# EAGLE design APM1_oilpan-V1 (EAGLE 9.6.2)
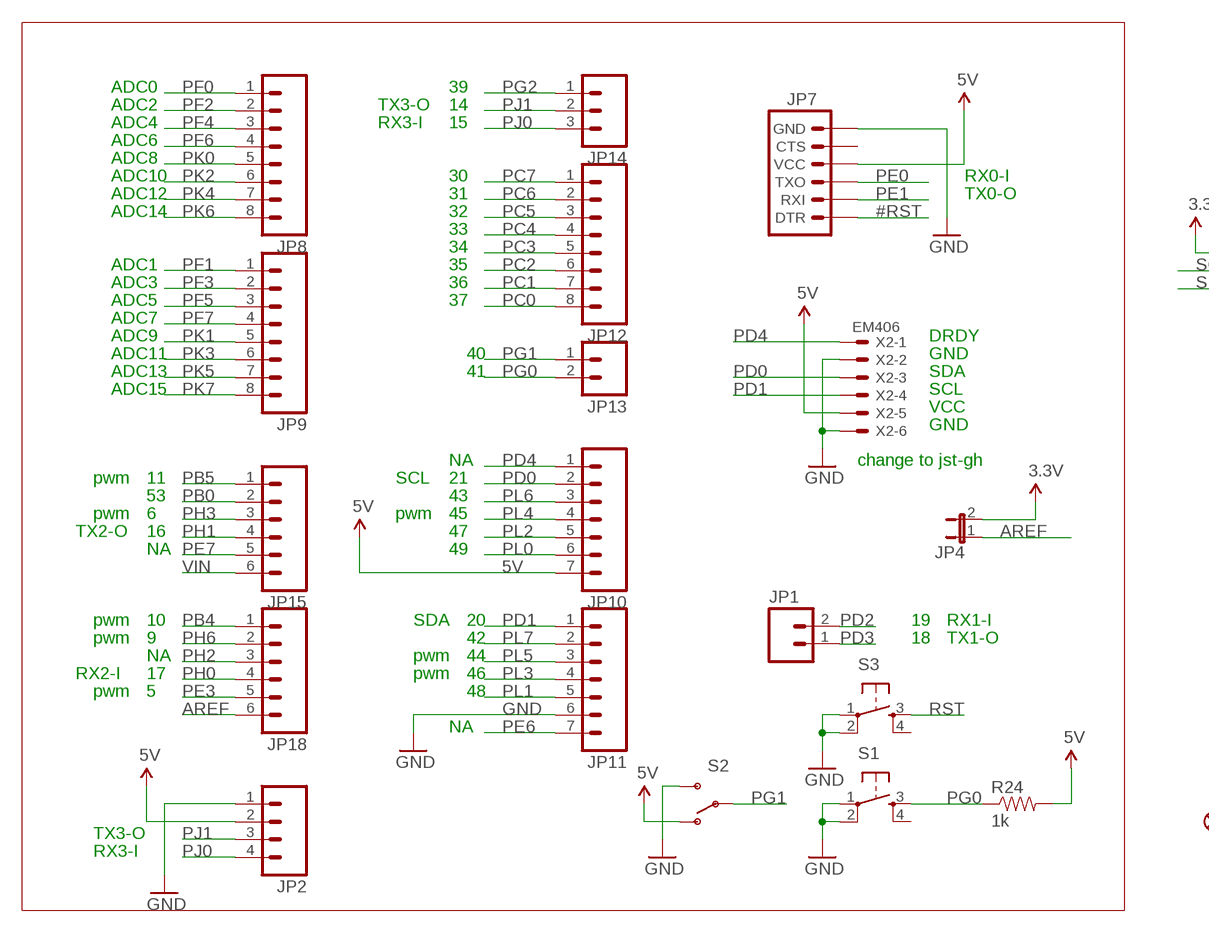
[diagram p0: schematic, sheet 1, part 1 of 2]
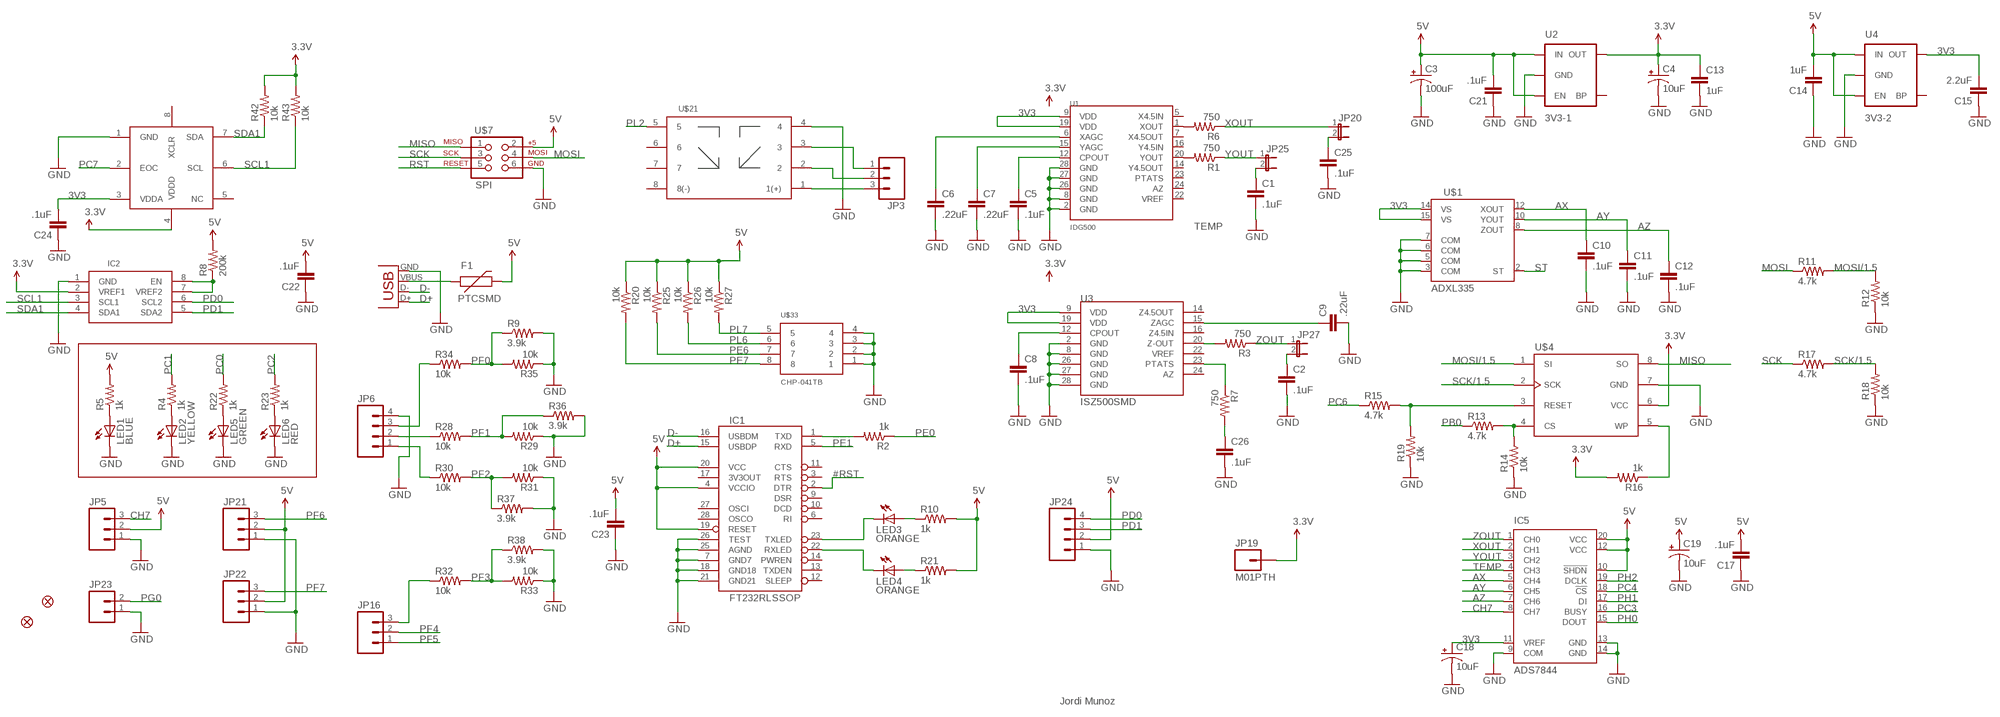
[diagram p1: schematic, sheet 1, part 2 of 2]

## Parts
C1  .1uF  CAP0402  [C0402]
C2  .1uF  CAP0402  [C0402]
C3  100uF  CAP_POL3528  [EIA3528]
C4  10uF  CAP_POL1206  [EIA3216]
C5  .1uF  CAP0402  [C0402]
C6  .22uF  CAP0402  [C0402]
C7  .22uF  CAP0402  [C0402]
C8  .1uF  CAP0402  [C0402]
C9  .22uF  CAP0402  [C0402]
C10  .1uF  CAP0402  [C0402]
C11  .1uF  CAP0402  [C0402]
C12  .1uF  CAP0402  [C0402]
C13  1uF  CAP0402  [C0402]
C14  1uF  CAP0402  [C0402]
C15  2.2uF  CAP0402  [C0402]
C17  .1uF  CAP0402  [C0402]
C18  10uF  CAP_POL1206  [EIA3216]
C19  10uF  CAP_POL1206  [EIA3216]
C21  .1uF  CAP0402  [C0402]
C22  .1uF  CAP0402  [C0402]
C23  .1uF  CAP0402  [C0402]
C24  .1uF  CAP0402  [C0402]
C25  .1uF  CAP0402  [C0402]
C26  .1uF  CAP0402  [C0402]
F1  PTCSMD  [PTC-1206]
IC1  FT232RLSSOP  [SSOP28DB]
IC2  PCA9306  [SOIC8]
IC5  ADS7844  ADS8344U  [SSOP20BU]
JP1  M02PTH  [1X02]
JP2  M04PTH  [1X04]
JP3  M03PTH  [1X03]
JP4  JUMPER-2SMD-NO  [SJ_2S-NO]
JP5  M03PTH  [1X03]
JP6  M04PTH  [1X04]
JP7  ARDUINO_SERIAL_PROGRAMPTH  [1X06]
JP8  M08  [1X08]
JP9  M08  [1X08]
JP10  M07  [1X07]
JP11  M07  [1X07]
JP12  M08  [1X08]
JP13  M02PTH  [1X02]
JP14  M03PTH  [1X03]
JP15  M06SIP  [1X06]
JP16  M03PTH  [1X03]
JP17  FIDUCIAL1X2.5  [FIDUCIAL-1X2.5]
JP18  M06SIP  [1X06]
JP19  M01PTH  [1X01]
JP20  JUMPER-2SMD-NO  [SJ_2S-NO]
JP21  M03PTH  [1X03]
JP22  M03PTH  [1X03]
JP23  M02PTH  [1X02]
JP24  M04PTH  [1X04]
JP25  JUMPER-2SMD-NO  [SJ_2S-NO]
JP26  FIDUCIAL1X2.5  [FIDUCIAL-1X2.5]
JP27  JUMPER-2SMD-NO  [SJ_2S-NO]
LED1  BLUE  LED0603  [LED-0603]
LED2  YELLOW  LED0603  [LED-0603]
LED3  ORANGE  LED0603  [LED-0603]
LED4  ORANGE  LED0603  [LED-0603]
LED5  GREEN  LED0603  [LED-0603]
LED6  RED  LED0603  [LED-0603]
R1  750  RESISTOR0402  [C0402]
R2  1k  RESISTOR0402  [C0402]
R3  750  RESISTOR0402  [C0402]
R4  1k  RESISTOR0402  [C0402]
R5  1k  RESISTOR0402  [C0402]
R6  750  RESISTOR0402  [C0402]
R7  750  RESISTOR0402  [C0402]
R8  200k  RESISTOR0402  [C0402]
R9  3.9k  RESISTOR0402  [C0402]
R10  1k  RESISTOR0402  [C0402]
R11  4.7k  RESISTOR0402  [C0402]
R12  10k  RESISTOR0402  [C0402]
R13  4.7k  RESISTOR0402  [C0402]
R14  10k  RESISTOR0402  [C0402]
R15  4.7k  RESISTOR0402  [C0402]
R16  1k  RESISTOR0402  [C0402]
R17  4.7k  RESISTOR0402  [C0402]
R18  10k  RESISTOR0402  [C0402]
R19  10k  RESISTOR0402  [C0402]
R20  10k  RESISTOR0402  [C0402]
R21  1k  RESISTOR0402  [C0402]
R22  1k  RESISTOR0402  [C0402]
R23  1k  RESISTOR0402  [C0402]
R24  1k  RESISTOR0402  [C0402]
R25  10k  RESISTOR0402  [C0402]
R26  10k  RESISTOR0402  [C0402]
R27  10k  RESISTOR0402  [C0402]
R28  10k  RESISTOR0402  [C0402]
R29  10k  RESISTORPTH1  [AXIAL-0.3]
R30  10k  RESISTOR0402  [C0402]
R31  10k  RESISTORPTH1  [AXIAL-0.3]
R32  10k  RESISTOR0402  [C0402]
R33  10k  RESISTORPTH1  [AXIAL-0.3]
R34  10k  RESISTOR0402  [C0402]
R35  10k  RESISTORPTH1  [AXIAL-0.3]
R36  3.9k  RESISTOR0402  [C0402]
R37  3.9k  RESISTOR0402  [C0402]
R38  3.9k  RESISTOR0402  [C0402]
R42  10k  RESISTOR0402  [C0402]
R43  10k  RESISTOR0402  [C0402]
S1  TAC_SWITCHSMD  [TACTILE_SWITCH_SMD]
S2  SWITCH-SPSTSMD2  [SWITCH-SPDT-SMD]
S3  TAC_SWITCHSMD  [TACTILE_SWITCH_SMD]
U1  IDG500  [QFN-28_6X8]
U2  3V3-1  V_REG_LDOSMD  [SOT23-5]
U3  ISZ500SMD  [QFN-28_6X8]
U4  3V3-2  V_REG_LDOSMD  [SOT23-5]
U$1  ADXL335  ADXL330SMD  [LFCSP-16]
U$4  DF  ATMEL_DATA_FLASH  [SO08WIDE]
U$7  SPI  AVR_SPI_PRG_6NS  [2X3-NS]
U$8  BMP085  [BMP085]
U$21  RELAY_23  [RELAY_23]
U$33  CHP-041TB  [CHP-041TB]
X1  USBSMD  [USB-MINIB]
X2  EM406  GH-06V  [GH-06V]

## Nets
3.3V: C4.A(+) C13.1 IC2.2(VREF1) JP4.2 JP19.1 R16.2 R42.2 R43.2 U2.5(OUT) U$4.6(VCC) U$8.4(VDDD)
3V3: C15.2 C18.A(+) C24.2 IC5.11(VREF) U1.9(VDD) U1.19(VDD) U3.9(VDD) U3.19(VDD) U4.5(OUT) U$1.14(VS) U$1.15(VS) U$8.3(VDDA)
5V: C3.A(+) C14.2 C17.2 C19.A(+) C21.2 C22.2 C23.2 F1.2 IC1.4(VCCIO) IC1.19(RESET) IC1.20(VCC) IC5.10(!SHDN) IC5.12(VCC) IC5.20(VCC) JP2.2 JP5.2 JP7.4(VCC) JP10.7 JP21.2 JP22.2 JP24.2 R5.2 R8.2 R10.2 R20.1 R21.2 R24.2 R25.1 R26.1 R27.1 S2.1(O) U2.1(IN) U2.3(EN) U4.1(IN) U4.3(EN) U$7.2 X2.5
#RST: IC1.2(DTR) JP7.1(DTR)
AREF: JP4.1 JP18.6
AX: C10.1 IC5.5(CH4) U$1.12(XOUT)
AY: C11.1 IC5.6(CH5) U$1.10(YOUT)
AZ: C12.1 IC5.7(CH6) U$1.8(ZOUT)
CH7: IC5.8(CH7) JP5.3
D+: IC1.15(USBDP) X1.D+
D-: IC1.16(USBDM) X1.D-
GND: C1.2 C2.2 C3.C(-) C4.C(-) C5.2 C6.2 C7.2 C8.2 C9.2 C10.2 C11.2 C12.2 C13.2 C14.1 C15.1 C17.1 C18.C(-) C19.C(-) C21.1 C22.1 C23.1 C24.1 C25.2 C26.2 IC1.7(GND7) IC1.18(GND18) IC1.21(GND21) IC1.25(AGND) IC1.26(TEST) IC2.1(GND) IC5.9(COM) IC5.13(GND) IC5.14(GND) JP2.1 JP5.1 JP6.4 JP7.6(GND) JP11.6 JP21.1 JP22.1 JP23.1 JP24.1 LED1.C LED2.C LED5.C LED6.C R9.2 R12.1 R14.1 R18.1 R19.1 R29.P$1 R31.P$1 R33.P$1 R35.P$1 R36.2 R37.2 R38.2 S1.1 S1.2 S2.3(S) S3.1 S3.2 U1.2(GND) U1.8(GND) U1.26(GND) U1.27(GND) U1.28(GND) U2.2(GND) U3.2(GND) U3.8(GND) U3.26(GND) U3.27(GND) U3.28(GND) U4.2(GND) U$1.3(COM) U$1.5(COM) U$1.6(COM) U$1.7(COM) U$4.7(GND) U$7.6 U$8.1(GND) U$21.4 U$33.1 U$33.2 U$33.3 U$33.4 X1.GND X2.2 X2.6
MISO: U$4.8(SO) U$7.1
MOSI: R11.1 U$7.4
MOSI/1.5: R11.2 R12.2 U$4.1(SI)
N$1: LED1.A R5.1
N$2: LED2.A R4.1
N$3: C8.1 U3.12(CPOUT)
N$4: C9.1 U3.15(ZAGC)
N$5: LED3.A R10.1
N$6: IC1.1(TXD) R2.2
N$7: R15.2 R19.2 U$4.3(RESET)
N$8: R3.2 U3.20(Z-OUT)
N$9: R7.1 U3.23(PTATS)
N$10: IC2.7(VREF2) IC2.8(EN) R8.1
N$11: JP3.1 U$21.3
N$12: R1.2 U1.20(YOUT)
N$13: C6.1 U1.6(XAGC)
N$14: R13.2 R14.2 U$4.4(CS)
N$15: R6.2 U1.1(XOUT)
N$16: C5.1 U1.12(CPOUT)
N$17: F1.1 X1.VBUS
N$18: C7.1 U1.15(YAGC)
N$20: C2.1 JP27.2
N$21: JP3.2 U$21.2
N$22: LED4.A R21.1
N$23: C25.1 JP20.2
N$24: IC1.23(TXLED) LED3.C
N$25: IC1.22(RXLED) LED4.C
N$26: LED5.A R22.1
N$27: LED6.A R23.1
N$28: JP3.3 U$21.1(1(+))
N$29: C1.1 JP25.2
N$34: JP6.2 R28.1
N$36: JP6.1 R30.1
N$38: JP16.3 R32.1
N$40: JP6.3 R34.1
PB0: JP15.2 R13.1
PB4: JP18.1
PB5: JP15.1
PC0: JP12.8 R22.2
PC1: JP12.7 R4.2
PC2: JP12.6 R23.2
PC3: IC5.16(BUSY) JP12.5
PC4: IC5.18(!CS) JP12.4
PC5: JP12.3
PC6: JP12.2 R15.1
PC7: JP12.1 U$8.2(EOC)
PD0: IC2.6(SCL2) JP10.2 JP24.4 X2.3
PD1: IC2.5(SDA2) JP11.1 JP24.3 X2.4
PD2: JP1.2
PD3: JP1.1
PD4: JP10.1 X2.1
PE0: JP7.3(TXO) R2.1
PE1: IC1.5(RXD) JP7.2(RXI)
PE3: JP18.5
PE6: JP11.7 R25.2 U$33.7
PE7: JP15.5 R20.2 U$33.8
PF0: JP8.1 R9.1 R34.2 R35.P$2
PF1: JP9.1 R28.2 R29.P$2 R36.1
PF2: JP8.2 R30.2 R31.P$2 R37.1
PF3: JP9.2 R32.2 R33.P$2 R38.1
PF4: JP8.3 JP16.2
PF5: JP9.3 JP16.1
PF6: JP8.4 JP21.3
PF7: JP9.4 JP22.3
PG0: JP13.2 JP23.2 R24.1 S1.3
PG1: JP13.1 S2.2(P)
PG2: JP14.1
PH0: IC5.15(DOUT) JP18.4
PH1: IC5.17(DI) JP15.4
PH2: IC5.19(DCLK) JP18.3
PH3: JP15.3
PH6: JP18.2
PJ0: JP2.4 JP14.3
PJ1: JP2.3 JP14.2
PK0: JP8.5
PK1: JP9.5
PK2: JP8.6
PK3: JP9.6
PK4: JP8.7
PK5: JP9.7
PK6: JP8.8
PK7: JP9.8
PL0: JP10.6
PL1: JP11.5
PL2: JP10.5 U$21.5
PL3: JP11.4
PL4: JP10.4
PL5: JP11.3
PL6: JP10.3 R26.2 U$33.6
PL7: JP11.2 R27.2 U$33.5
RST: S3.3 U$7.5
SCK: R17.1 U$7.3
SCK/1.5: R17.2 R18.2 U$4.2(SCK)
SCL1: IC2.3(SCL1) R43.1 U$8.6(SCL)
SDA1: IC2.4(SDA1) R42.1 U$8.7(SDA)
ST: U$1.2(ST)
TEMP: C26.1 IC5.4(CH3) R7.2
VIN: JP15.6
WP: R16.1 U$4.5(WP)
XOUT: IC5.2(CH1) JP20.1 R6.1
YOUT: IC5.3(CH2) JP25.1 R1.1
ZOUT: IC5.1(CH0) JP27.1 R3.1
Unconnected: IC1.3(RTS) IC1.6(RI) IC1.9(DSR) IC1.10(DCD) IC1.11(CTS) IC1.12(SLEEP) IC1.13(TXDEN) IC1.14(PWREN) IC1.17(3V3OUT) IC1.27(OSCI) IC1.28(OSCO) JP7.5(CTS) S1.4 S3.4 U1.5(X4.5IN) U1.7(X4.5OUT) U1.14(Y4.5OUT) U1.16(Y4.5IN) U1.22(VREF) U1.23(PTATS) U1.24(AZ) U2.4(BP) U3.14(Z4.5OUT) U3.16(Z4.5IN) U3.22(VREF) U3.24(AZ) U4.4(BP) U$8.5(NC) U$8.8(XCLR) U$21.6 U$21.7

## Notes on the sheet
- ADC0 | 39
- ADC2 | TX3-O | 14
- ADC4 | RX3-I | 15
- ADC6
- ADC8
- ADC10 | 30 | RX0-I
- ADC12 | 31 | TX0-O
- ADC14 | 32
- 33
- 34
- ADC1 | 35
- ADC3 | 36
- ADC5 | 37
- ADC7
- ADC9 | DRDY
- ADC11 | 40 | GND
- ADC13 | 41 | SDA
- ADC15 | SCL
- VCC
- GND
- NA | change to jst-gh
- pwm | 11 | SCL | 21
- 53 | 43
- pwm | 6 | pwm | 45
- TX2-O | 16 | 47
- NA | 49
- pwm | 10 | SDA | 20 | 19 | RX1-I
- pwm | 9 | 42 | 18 | TX1-O
- NA | pwm | 44
- RX2-I | 17 | pwm | 46
- pwm | 5 | 48
- NA
- TX3-O
- RX3-I
- Jordi Munoz

## Power pins joined to a net without a drawn wire
8(-): U$21.8(8(-))

## Library data of the parts
C1 C2 C5-C15 C17 C21-C26 = DIYdrones3:CAP: Capacitor Standard 0603 ceramic capacitor, and 0.1" leaded capacitor.
C3 C4 C18 C19 = DIYdrones3:CAP_POL: Capacitor Polarized These are standard SMD and PTH capacitors. Normally 10uF, 47uF, and 100uF in electrolytic and tantalum varieties. Always verify the external diameter of the through hole cap, it varies with capacity, voltage, and manufacturer. The EIA devices should be standard.
F1 = DIYdrones3:PTC: Resettable Fuse PTC Resettable Fuse. Spark Fun Electronics SKU : COM-08357
IC1 = SparkFun:FT232RL: USB UART FT232RL 4th Generation USB UART (USB <-> Serial) Controller. Spark Fun Electronics SKU : COM-00650
IC2 = DIYdrones:PCA9306: I2C Level translator. Digi-Key part: 568-4215-1-ND By Jordi Munoz
IC5 = burr-brown:ADS8344: 16-Bit, 8-Channel Serial Output Sampling ADC
JP1 JP13 JP23 = DIYdrones3:M02: Header 2 Standard 2-pin 0.1" header. Use with straight break away headers (SKU : PRT-00116), right angle break away headers (PRT-00553), swiss pins (PRT-00743), machine pins (PRT-00117), and female headers (PRT-00115). Molex polarized connector foot print use with SKU : PRT-08233 with associated crimp pins and housings.
JP2 JP6 JP24 = DIYdrones3:M04: Header 4 Standard 4-pin 0.1" header. Use with straight break away headers (SKU : PRT-00116), right angle break away headers (PRT-00553), swiss pins (PRT-00743), machine pins (PRT-00117), and female headers (PRT-00115). Molex polarized connector foot print use with SKU : PRT-08231 with associated crimp pins and housings.
JP3 JP5 JP14 JP16 JP21 JP22 = DIYdrones3:M03: Header 3 Standard 3-pin 0.1" header. Use with straight break away headers (SKU : PRT-00116), right angle break away headers (PRT-00553), swiss pins (PRT-00743), machine pins (PRT-00117), and female headers (PRT-00115). Molex polarized connector foot print use with SKU : PRT-08232 with associated crimp pins and housings.
JP4 JP20 JP25 JP27 = DIYdrones3:JUMPER-2: Jumper Basic 0.1" spaced jumper. Use with breakaway headers.
JP7 = DIYdrones3:ARDUINO_SERIAL_PROGRAM
JP8 JP9 JP12 = DIYdrones3:M08: Header 8 Standard 8-pin 0.1" header. Use with straight break away headers (SKU : PRT-00116), right angle break away headers (PRT-00553), swiss pins (PRT-00743), machine pins (PRT-00117), and female headers (PRT-00115).
JP10 JP11 = DIYdrones3:M07: Header 7 Standard 7-pin 0.1" header. Use with straight break away headers (SKU : PRT-00116), right angle break away headers (PRT-00553), swiss pins (PRT-00743), machine pins (PRT-00117), and female headers (PRT-00115). NOTES ON THE VARIANTS LOCK and LOCK_LONGPADS... This footprint was designed to help hold the alignment of a through-hole component (i.e. 7-pin header) while soldering it into place. You may notice that each hole has been shifted either up or down by 0.005 of an inch from it's more standard position (which is usually a perfectly straight line). This slight alteration caused the pins (the squares in the middle) to touch the edges of the holes. Because they are alternating, it causes a "brace" to hold the header in place. 0.005 has proven to be the perfect amount of "off-center" position when using our standard breakaway headers. Although looks a little odd when you look at the bare footprint, once you have a header in there, the alteration is very hard to notice. Also, if you push a header all the way into place, it is covered up entirely on the bottom side. This idea of altering the position of holes to aid alignment will be further integrated into the Sparkfun Library for other footprints. It can help hold any component with 3 or more connection pins.
JP15 JP18 = DIYdrones3:M06: Header 6 Standard 6-pin 0.1" header. Use with straight break away headers (SKU : PRT-00116), right angle break away headers (PRT-00553), swiss pins (PRT-00743), machine pins (PRT-00117), and female headers (PRT-00115). Molex polarized connector foot print use with SKU : PRT-08094 with associated crimp pins and housings. NOTES ON THE VARIANTS LOCK and LOCK_LONGPADS... This footprint was designed to help hold the alignment of a through-hole component (i.e. 6-pin header) while soldering it into place. You may notice that each hole has been shifted either up or down by 0.005 of an inch from it's more standard position (which is a perfectly straight line). This slight alteration caused the pins (the squares in the middle) to touch the edges of the holes. Because they are alternating, it causes a "brace" to hold the component in place. 0.005 has proven to be the perfect amount of "off-center" position when using our standard breakaway headers. Although looks a little odd when you look at the bare footprint, once you have a header in there, the alteration is very hard to notice. Also, if you push a header all the way into place, it is covered up entirely on the bottom side. This idea of altering the position of holes to aid alignment will be further integrated into the Sparkfun Library for other footprints. It can help hold any component with 3 or more connection pins.
JP17 JP26 = SparkFun:FIDUCIAL: Fiducial Alignment Points Various fiducial points for machine vision alignment.
JP19 = DIYdrones3:M01: Header 1 Standard 1-pin 0.1" header. Use with straight break away headers (SKU : PRT-00116), right angle break away headers (PRT-00553), swiss pins (PRT-00743), machine pins (PRT-00117), and female headers (PRT-00115).
LED1-LED6 = DIYdrones3:LED: LEDs Standard schematic elements and footprints for 5mm, 3mm, 1206, and 0603 sized LEDs. 5mm - Spark Fun Electronics SKU : COM-00529 (and others)
R1-R38 R42 R43 = DIYdrones3:RESISTOR: Resistor Basic schematic elements and footprints for 0603, 1206, and PTH 1/10th watt (small) resistors.
S1 S3 = DIYdrones3:TAC_SWITCH: Momentary Switch Button commonly used for reset or general input. Spark Fun Electronics SKU : COM-00097
S2 = SparkFun:SWITCH-SPST: SPST Switch Simple slide switch. Spark Fun Electronics SKU : COM-00102
U1 = DIYdrones_112210:IDG500
U2 U4 = SparkFun:V_REG_LDO: Voltage Regulator LDO Standard 150mA LDO voltage regulator in SOT-23 layout. Micrel part MIC5205. BP (by-pass) pin is used to lower output noise with 470pF cap.
U3 = DIYdrones_112210:ISZ500: ISZ500 Single axis gyro
U$1 = DIYdrones3:ADXL330: Triple Axis Accelerometer Analog Devices ADXL330 +/-3g 2.4V-5.25V Analog output. Spark Fun Electronics SKU : COM-00730. Center pad paste layer has been reduced to avoid shorting.
U$4 = DIYdrones3:ATMEL_DATA_FLASH: 16Mbit EEPROM DataFlash Footprint needs touching up. Spark Fun Electronics SKU : COM-00301
U$7 = DIYdrones3:AVR_SPI_PRG_6: AVR ISP 6 Pin This is the reduced ISP connector for AVR programming. Common on Arduino. This footprint will take up less PCB space and can be used with a 10-pin to 6-pin adapter such as SKU: BOB-08508
U$8 = SparkFun:BMP085
U$21 = DIYdrones:RELAY_23
U$33 = DIYdrones:CHP-041TB: By Jordi Munoz, for DIYDrones.com (3DRRobotics LLC).
X1 = DIYdrones3:USB: USB Connectors USB-B-PTH is fully proven SKU : PRT-00139 USB-miniB is fully proven SKU : PRT-00587 USB-A-PCB is untested. USB-A-H is throughly reviewed, but untested. Spark Fun Electronics SKU : PRT-00437 USB-B-SMT is throughly reviewed, but untested. Needs silkscreen touching up. USB-A-S has not been used/tested USB-MB-H has not been used/tested
X2 = jst_gh_con:GH-06V: Disconnectable Crimp style connector, 1.25mm pitch 6 contacts

## Board
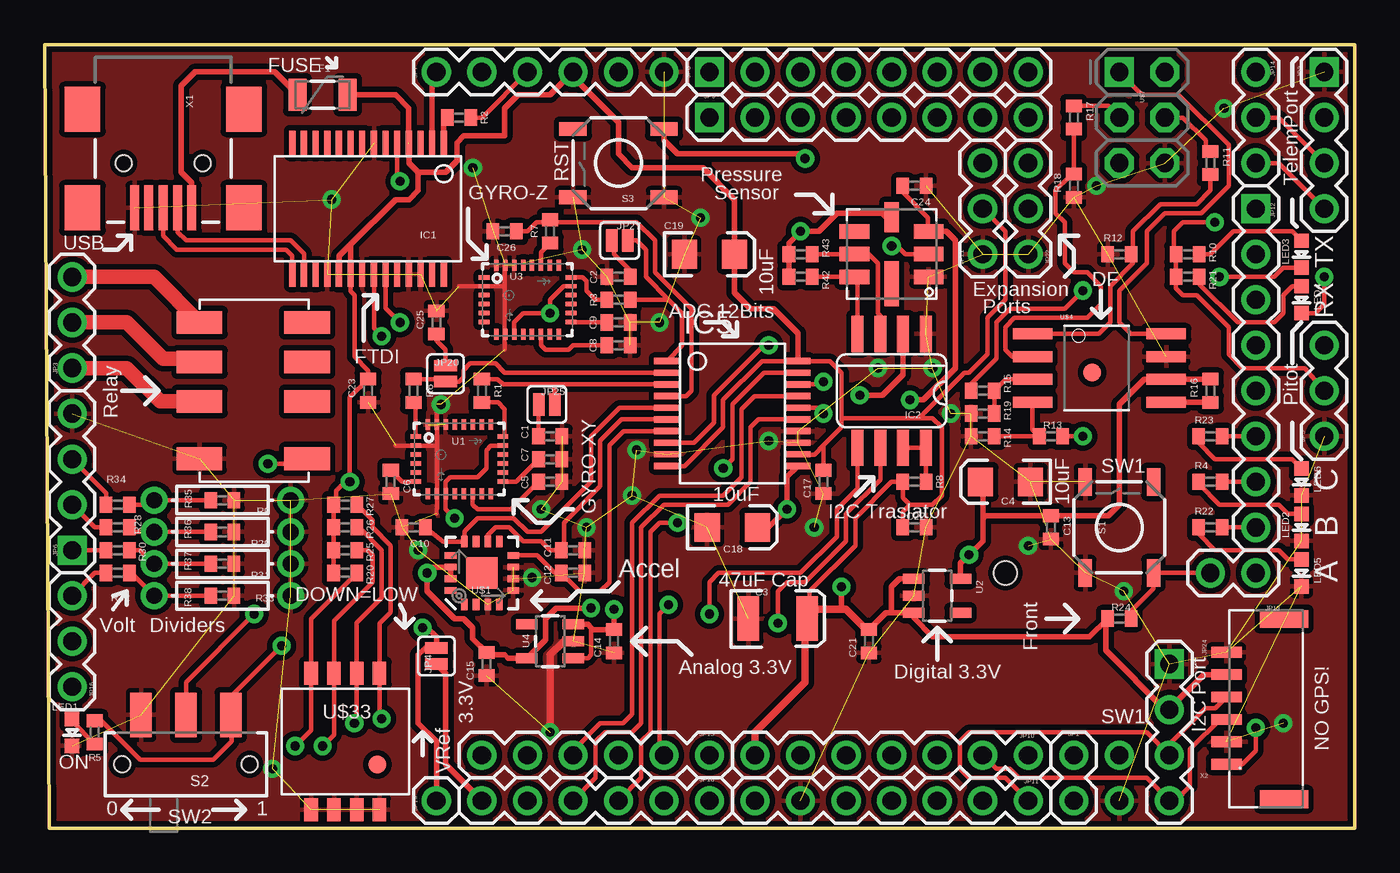
[diagram p2: board, top side]
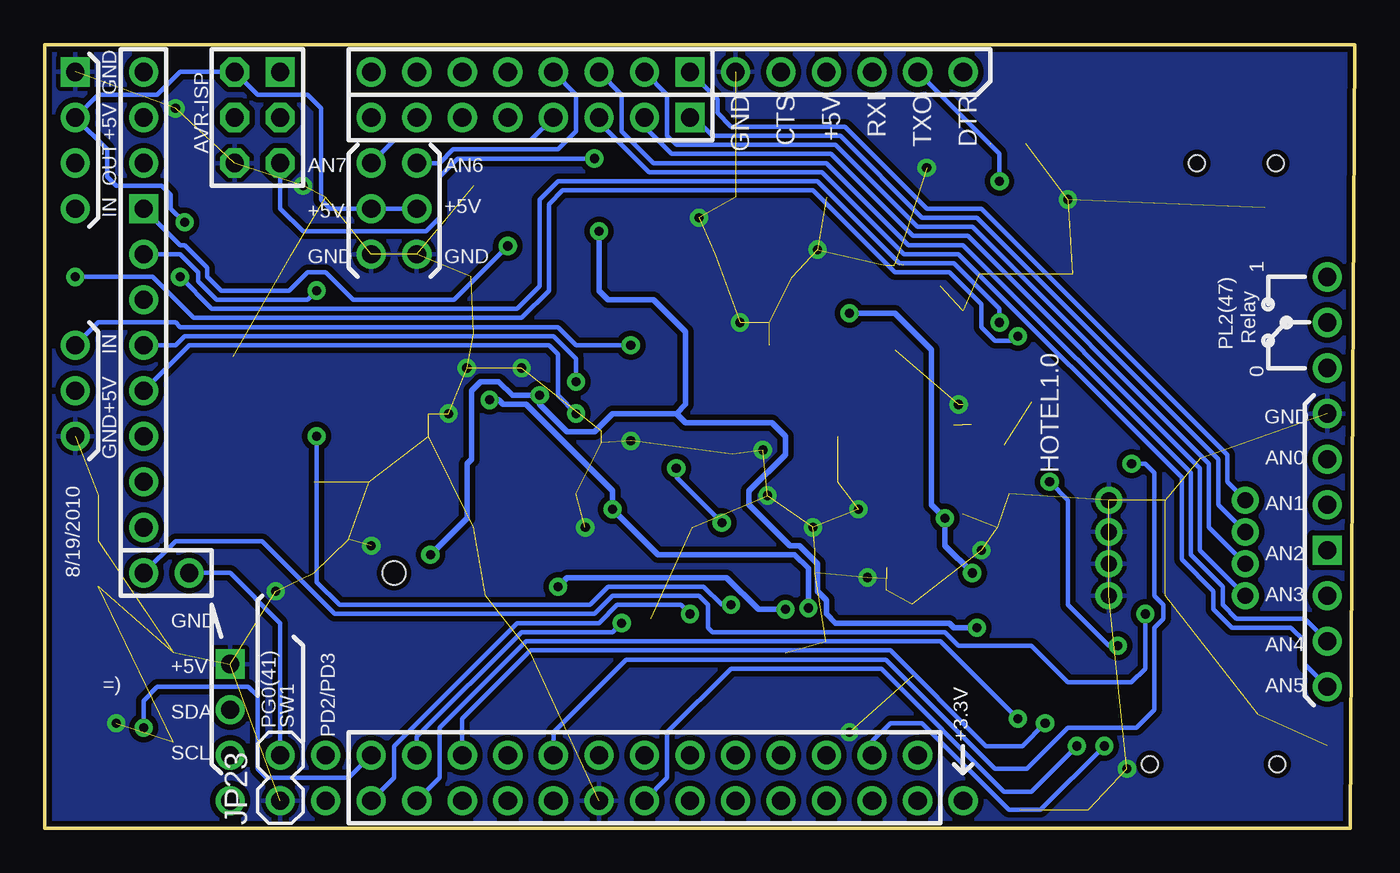
[diagram p3: board, bottom side, seen from below]

Size 73.08 x 43.68 mm. Coordinates in mm from the lower left corner, seen from the top.
Outline: 0.25,0 73.08,0 73.08,43.68 0,43.68 0.25,0
Copper layers (1*16): Top 0.035mm / dielectric 1.5mm / Bottom 0.035mm
Design rules "SparkFun": minimum track width 8mil, minimum drill 20mil, track to track 8mil, track to pad 8mil, pad to pad 8mil, via to via 8mil, smd to smd 8mil, copper to edge 10mil, drill to drill 8mil, minimum pad ring 12mil, minimum via ring 10mil, stop-mask expansion 4mil, vias tented up to drill 25mil, thermal gap 10mil
Holes 1.3 mm at 53.59,14.22

### Footprints (pad centres in the part's own frame; a part is rotated, then mirrored left to right if it is on the bottom)
C0402 = smd 0.7 x 0.9: 1 -0.65,0; 2 0.65,0
EIA3528 = smd 1.2 x 2.5: A 1.65,0; C -1.65,0
EIA3216 = smd 1.4 x 1.6: A 1.4,0; C -1.4,0
PTC-1206 = smd 1 x 1.8: 1 -1.4,0; 2 1.4,0
SSOP28DB = smd 0.348 x 1.397: 1 -4.225,-3.656; 2 -3.575,-3.656; 3 -2.925,-3.656; 4 -2.275,-3.656; 5 -1.625,-3.656; 6 -0.975,-3.656; 7 -0.325,-3.656; 8 0.325,-3.656; 9 0.975,-3.656; 10 1.625,-3.656; 11 2.275,-3.656; 12 2.925,-3.656; 13 3.575,-3.656; 14 4.225,-3.656; 15 4.225,3.656; 16 3.575,3.656; 17 2.925,3.656; 18 2.275,3.656; 19 1.625,3.656; 20 0.975,3.656; 21 0.325,3.656; 22 -0.325,3.656; 23 -0.975,3.656; 24 -1.625,3.656; 25 -2.275,3.656; 26 -2.925,3.656; 27 -3.575,3.656; 28 -4.225,3.656
SOIC8 = smd 0.66 x 2.032: 1 -1.905,-3.175; 2 -0.635,-3.175; 3 0.635,-3.175; 4 1.905,-3.175; 5 1.905,3.175; 6 0.635,3.175; 7 -0.635,3.175; 8 -1.905,3.175
SSOP20BU = smd 0.348 x 1.397: 1 -2.925,-3.656; 2 -2.275,-3.656; 3 -1.625,-3.656; 4 -0.975,-3.656; 5 -0.325,-3.656; 6 0.325,-3.656; 7 0.975,-3.656; 8 1.625,-3.656; 9 2.275,-3.656; 10 2.925,-3.656; 11 2.925,3.656; 12 2.275,3.656; 13 1.625,3.656; 14 0.975,3.656; 15 0.325,3.656; 16 -0.325,3.656; 17 -0.975,3.656; 18 -1.625,3.656; 19 -2.275,3.656; 20 -2.925,3.656
1X02 = drill 1.016: 1 0,0; 2 2.54,0
1X04 = drill 1.016 square: 1 0,0 | drill 1.016: 2 2.54,0; 3 5.08,0; 4 7.62,0
1X03 = drill 1.016: 1 0,0; 2 2.54,0; 3 5.08,0
SJ_2S-NO = smd 0.635 x 1.27: 1 0,0; 2 0.889,0
1X06 = drill 1.016: 1 0,0; 2 2.54,0; 3 5.08,0; 4 7.62,0; 5 10.16,0; 6 12.7,0
1X08 = drill 1.016 square: 1 0,0 | drill 1.016: 2 2.54,0; 3 5.08,0; 4 7.62,0; 5 10.16,0; 6 12.7,0; 7 15.24,0; 8 17.78,0
1X07 = drill 1.016: 1 0,0; 2 2.54,0; 3 5.08,0; 4 7.62,0; 5 10.16,0; 6 12.7,0; 7 15.24,0
FIDUCIAL-1X2.5 = smd 1 x 1: 1 0,0
1X01 = drill 1.016: 1 0,0
LED-0603 = smd 0.8 x 0.8: A 0,-0.75; C 0,0.75
AXIAL-0.3 = drill 0.9: P$1 -3.81,0; P$2 3.81,0
TACTILE_SWITCH_SMD = smd 1.524 x 0.762: 1 -2.54,1.905; 2 2.54,1.905; 3 -2.54,-1.905; 4 2.54,-1.905
SWITCH-SPDT-SMD = smd 1.2 x 2.5: 1 -2.5,-2.75; 2 0,-2.75; 3 2.5,-2.75 | hole 0.9: -3.55,0; 3.55,0
QFN-28_6X8 = smd 0.6 x 0.25: 1 -2.417,1.25; 2 -2.417,0.75; 3 -2.417,0.25; 4 -2.417,-0.25; 5 -2.417,-0.75; 6 -2.417,-1.25; 15 2.433,-1.25; 16 2.433,-0.75; 17 2.433,-0.25; 18 2.433,0.25; 19 2.433,0.75; 20 2.433,1.25 | smd 0.25 x 0.6: 7 -1.742,-1.925; 8 -1.242,-1.925; 9 -0.742,-1.925; 10 -0.242,-1.925; 11 0.258,-1.925; 12 0.758,-1.925; 13 1.258,-1.925; 14 1.758,-1.925; 21 1.758,1.925; 22 1.258,1.925; 23 0.758,1.925; 24 0.258,1.925; 25 -0.242,1.925; 26 -0.742,1.925; 27 -1.242,1.925; 28 -1.742,1.925
SOT23-5 = smd 0.55 x 1.2: 1 -0.95,-1.3; 2 0,-1.3; 3 0.95,-1.3; 4 0.95,1.3; 5 -0.95,1.3
LFCSP-16 = smd 1.75 x 1.75: 0 0,0 | smd 0.65 x 0.37: 1 -1.75,0.975; 2 -1.75,0.325; 3 -1.75,-0.325; 4 -1.75,-0.975; 9 1.75,-0.975; 10 1.75,-0.325; 11 1.75,0.325; 12 1.75,0.975 | smd 0.37 x 0.65: 5 -0.975,-1.75; 6 -0.325,-1.75; 7 0.325,-1.75; 8 0.975,-1.75; 13 0.975,1.75; 14 0.325,1.75; 15 -0.325,1.75; 16 -0.975,1.75
SO08WIDE = smd 0.61 x 2.21: 1 -1.905,-3.569; 2 -0.635,-3.569; 3 0.635,-3.569; 4 1.905,-3.569; 5 1.905,3.886; 6 0.635,3.886; 7 -0.635,3.886; 8 -1.905,3.886
2X3-NS = drill 1.016 square: 1 -2.54,-1.27 | drill 1.016 octagon: 2 -2.54,1.27; 3 0,-1.27; 4 0,1.27; 5 2.54,-1.27; 6 2.54,1.27
BMP085 = smd 1.67 x 0.8: 1 -2.065,1.27; 2 -2.065,0; 3 -2.065,-1.27; 5 2.065,-1.27; 6 2.065,0; 7 2.065,1.27 | smd 0.8 x 1.67: 4 0,-2.065 | smd 0.8 x 2.5: 8 0,1.65
RELAY_23 = smd 1.27 x 2.54: 1 3.806,3.048; 2 1.606,3.048; 3 -0.594,3.048; 4 -3.794,3.048; 5 -3.794,-2.952; 6 -0.594,-2.952; 7 1.606,-2.952; 8 3.806,-2.952
CHP-041TB = smd 0.76 x 1.27: 1 -1.905,-3.81; 2 -0.635,-3.81; 3 0.635,-3.81; 4 1.905,-3.81; 5 1.905,3.81; 6 0.635,3.81; 7 -0.635,3.81; 8 -1.905,3.81
USB-MINIB = smd 2.5 x 0.5: D+ 2.5,0; D- 2.5,0.8; GND 2.5,-1.6; ID 2.5,-0.8; VBUS 2.5,1.6 | smd 2.5 x 2: GND@1 -3,-4.5; GND@2 -3,4.5; GND@3 2.5,4.5; GND@4 2.5,-4.5 | hole 0.9: 0,2.2; 0,-2.2
GH-06V = smd 0.6 x 1.7: 1 0,-0.9; 2 1.25,-0.9; 3 2.5,-0.9; 4 3.75,-0.9; 5 5,-0.9; 6 6.25,-0.9 | smd 1 x 2.7: FIT@1 -1.95,-4.1; FIT@2 8.1,-4.1

### Placement (x,y rotation side)
C1  28.19,21.84 0 top
C2  32,30.73 180 top
C3  40.89,11.68 0 top
C4  53.59,19.3 180 top
C5  28.19,19.3 0 top
C6  19.3,19.3 270 top
C7  28.19,20.57 0 top
C8  32,26.92 0 top
C9  32,28.19 0 top
C10  20.57,16.76 180 top
C11  29.46,15.49 0 top
C12  29.46,14.22 0 top
C13  56.13,16.76 270 top
C14  31.75,10.41 90 top
C15  24.64,9.14 90 top
C17  43.43,19.3 90 top
C18  38.35,16.76 0 top
C19  37.08,32 0 top
C21  45.97,10.41 90 top
C22  48.51,16.76 180 top
C23  18.03,24.38 90 top
C24  48.51,35.81 180 top
C25  21.84,28.19 90 top
C26  25.65,33.27 180 top
F1  15.49,40.89 0 top
IC1  18.03,34.54 180 top
IC2  47.24,24.38 180 top
IC5  38.35,23.11 270 top
JP1  57.4,4.06 270 top
JP2  71.37,42.16 270 top
JP3  1.52,25.65 90 top
JP4  21.84,9.14 90 top
JP5  71.37,21.84 90 top
JP6  1.52,15.49 90 top
JP7  21.84,42.16 0 top
JP8  37.08,42.16 0 top
JP9  37.08,39.62 0 top
JP10  54.86,4.06 180 top
JP11  54.86,1.52 180 top
JP12  67.56,34.54 270 top
JP13  67.56,14.22 180 top
JP14  67.56,42.16 270 top
JP15  37.08,4.06 180 top
JP16  1.52,7.87 90 top
JP17  18.54,3.56 0 top
JP18  37.08,1.52 180 top
JP19  21.84,1.52 0 top
JP20  22.35,24.89 90 top
JP21  52.32,32 90 top
JP22  54.86,32 90 top
JP23  59.94,1.52 90 bottom
JP24  62.74,9.14 270 top
JP25  28.45,23.62 180 top
JP26  58.42,25.4 0 top
JP27  32.51,32.77 180 top
LED1  1.52,5.33 180 top
LED2  70.1,16.76 180 top
LED3  70.1,32 180 top
LED4  70.1,29.46 180 top
LED5  70.1,14.22 180 top
LED6  70.1,19.3 180 top
R1  24.38,24.38 270 top
R2  23.11,39.62 180 top
R3  32,29.46 180 top
R4  65.02,19.3 0 top
R5  2.79,5.33 90 top
R6  20.57,24.38 270 top
R7  28.19,33.27 90 top
R8  48.51,19.3 180 top
R9  9.91,18.29 0 top
R10  63.75,32 180 top
R11  65.02,37.08 270 top
R12  59.94,32 0 top
R13  56.13,21.84 180 top
R14  52.32,21.84 0 top
R15  52.32,24.38 0 top
R16  65.02,24.38 90 top
R17  57.4,39.62 270 top
R18  57.4,35.81 90 top
R19  52.32,23.11 0 top
R20  16.76,14.22 0 top
R21  63.75,30.73 180 top
R22  65.02,16.76 0 top
R23  65.02,21.84 0 top
R24  59.94,11.68 180 top
R25  16.76,15.49 0 top
R26  16.76,16.76 0 top
R27  16.76,18.03 0 top
R28  4.06,16.76 0 top
R29  9.91,16.51 180 top
R30  4.06,15.49 0 top
R31  9.91,14.73 180 top
R32  4.06,14.22 0 top
R33  9.91,12.95 180 top
R34  4.06,18.03 0 top
R35  9.91,18.29 180 top
R36  9.91,16.51 0 top
R37  9.91,14.73 0 top
R38  9.91,12.95 0 top
R42  42.16,30.73 180 top
R43  42.16,32 180 top
S1  59.94,16.76 90 top
S2  7.87,3.56 180 top
S3  32,37.08 180 top
U1  23.11,20.57 0 top
U2  49.78,12.95 270 top
U3  26.92,29.46 0 top
U4  28.19,10.41 90 top
U$1  24.38,14.22 90 top
U$4  58.67,25.65 270 top
U$7  61.21,39.62 270 top
U$8  47.24,32 180 top
U$21  11.68,24.38 90 top
U$33  16.76,4.83 0 top
X1  6.6,37.08 270 top
X2  65.02,3.56 90 top

### Tracks (layer width: path | path; a pad name or v marks a point on that pad's centre or on a via)
3.3V  (via drill 0.51)
  Top 0.254: 65.01,25.02 R16.2 | 21.21,10.03 JP4.2 | 21.34,11.18 v21.08,11.18 | 46.96,34.07 U$8.4
  Top 0.305: 65.01,25.02 U$4.6 61.34,25.02 59.94,23.62 59.94,18.03 59.32,17.41 C13.1 52.47,17.41 52.32,17.27 | v45.47,24.13 46.74,24.13 47.88,25.27 IC2.2 | R42.2 R43.2 41.51,32.62 v42.16,33.27 43.18,33.27 44.2,34.29 46.74,34.29 46.96,34.07 | JP19.1 21.84,4.83 20.83,5.84 20.83,9.65 21.21,10.03 | 52.32,17.27 52.32,19.17 | 52.32,17.27 52.32,16 v51.56,15.24 51.08,14.76 U2.5 | JP4.2 21.84,10.67 21.34,11.18
  Top 0.406: 52.32,19.17 C4.A
  Bottom 0.305: v42.16,33.27 42.16,29.97 41.66,29.46 39.12,29.46 37.34,27.69 37.34,23.62 37.85,23.11 | v51.56,15.24 49.53,17.27 49.53,20.32 49.28,20.57 49.28,24.38 48.77,24.89 47.75,24.89 46.99,24.13 v45.47,24.13 45.47,23.62 43.94,22.1 42.42,22.1 41.4,23.11 37.85,23.11 | v21.08,11.18 22.35,11.18 22.61,11.43 28.96,11.43 29.46,11.94 29.46,12.7 29.97,13.21 29.97,14.73 30.99,15.75 31.5,15.75 33.78,18.03 33.78,18.8 31.75,20.83 31.75,21.84 32.51,22.61 37.34,22.61 37.85,23.11
3V3  (via drill 0.51)
  Top 0.254: U3.9 26.18,28.21 26.67,28.7 v28.19,28.7 28.19,29.46 28.94,30.21 U3.19 | U1.19 24.88,21.32 24.64,21.08 24.64,20.07 24.13,19.56 22.61,19.56 22.37,19.32 U1.9 22.37,17.8 22.35,17.78 v22.86,17.27 | 25.65,9.65 25.84,9.46 | C15.2 24.78,9.65 | C24.2 47.86,35.45 49.28,34.04 49.28,33.31 U$8.3
  Top 0.305: U$1.15 U$1.14 21.66,14.55 v21.34,14.22 21.34,13.21 22.86,11.68 23.37,11.68 23.88,11.18 23.88,10.56 C15.2 | 25.84,9.46 U4.5 27.94,10.51 27.94,11.68 28.52,12.27 v30.48,12.27 | 24.78,9.65 25.65,9.65 | C18.A 40.39,16.76 v41.4,17.78 41.4,19.58 IC5.11 | U$8.3 50.29,33.27 50.8,32.77 50.8,25.65 49.02,23.88 v48.26,23.88
  Bottom 0.305: v21.34,14.22 22.86,15.75 v22.86,17.27 23.62,18.03 23.62,26.67 25.65,28.7 v28.19,28.7 | v30.48,12.27 30.48,14.48 31.24,15.24 38.86,15.24 v41.4,17.78 41.4,18.8 46.23,23.62 47.5,23.62 47.75,23.88 v48.26,23.88
5V  (via drill 0.51)  (1 unrouted)
  Top 0.254: IC5.12 42.27,20.83 42.93,20.83 43.43,21.34 | IC5.10 35.68,20.19 37.85,22.35 37.85,23.88 40.01,26.04 IC5.20 43.81,26.04 44.45,25.4 44.45,22.86 | 44.45,22.86 44.45,22.35 43.43,21.34 | 43.43,21.34 C17.2 | 17.06,32.55 17.02,32.51 17.06,32.47 | JP5.2 70.32,25.62 70.28,25.65 66.8,25.65 66.04,26.42 66.04,27.94 64.26,29.72 63.5,29.72 63.1,30.11 R21.2 R10.2 62.99,32.12 62.99,33.27 63.5,33.78 v65.28,33.78 | v13.21,10.16 10.37,7.33 S2.1 10.41,6.27 10.41,4.83 9.4,3.81 5.33,3.81 3.16,5.98 R5.2 | 16.26,14.08 R20.1 R25.1 R26.1 R27.1 16.26,18.18 16.26,18.8 16.76,19.3 v17.02,19.3 17.02,24.02 C23.2 18.03,25.51 17.27,26.27 17.27,29.72 17.06,29.93 IC1.20 | JP21.2 53.59,33.27 53.59,29.46 52.58,28.45 52.58,26.42 51.56,25.4 51.31,25.4 48.77,22.86 | C3.A 42.42,11.3 | 45.83,11.06 C21.2 | 42.71,12.19 42.63,12.27 42.67,12.57 42.67,13.21 45.21,15.75 45.21,17.27 47.24,19.3 R8.2 47.86,18.43 48.26,18.03 | 44.45,22.86 48.77,22.86 | 48.26,18.03 49.53,18.03 50.04,18.54 50.04,22.35 49.53,22.86 48.77,22.86 | C22.2 47.86,17.64 48.26,18.03 | U4.1 30.29,9.46 30.48,9.65 30.48,11.18 30.59,11.06 | R24.2 59.18,11.57
  Top 0.305: 20.83,36.58 20.32,37.08 20.32,38.16 | 20.83,36.58 20.83,35.56 20.32,35.05 19.56,35.05 17.06,32.55 | F1.2 19.56,40.89 20.31,40.14 IC1.4 | R24.2 58.28,10.67 49.53,10.67 48.48,11.71 U2.3 47.24,12 | 20.83,36.58 22.35,36.58 22.99,37.21 22.99,38.23 23.37,38.61 25.65,38.61 25.65,40.13 26.42,40.89 28.19,40.89 JP7.4 29.46,41.91 32,39.37 32,37.59 32.77,36.83 36.71,36.83 38.48,35.05 C19.A 38.48,29.84 39.37,28.96 40.64,28.96 42.01,27.59 IC5.20 | 47.24,12 46.91,12 C21.2 | U2.1 47.69,13.9 47.24,13.46 47.24,12 | U4.3 30.29,11.36 30.48,11.18 | 30.59,11.06 C14.2 v31.75,12.19 | 44.45,12.19 v44.45,13.46 | X2.5 64.65,8.56 62.74,6.64 JP24.2 62.48,6.6 59.18,9.91 59.18,11.57 | IC1.20 17.06,32.47 | IC1.19 16.41,31.9 17.02,32.51
  Top 0.406: 39.62,5.08 JP10.7 39.62,5.33 42.42,8.13 42.42,11.3 | 42.63,12.27 C3.A | 45.83,11.06 44.7,12.19 44.45,12.19 42.71,12.19
  Bottom 0.254: JP21.2 JP22.2 57.15,34.54 57.66,35.05 57.66,40.13 58.42,40.89 61.21,40.89 U$7.2 65.53,42.16 66.8,40.89 70.1,40.89 JP2.2 69.6,37.85 69.6,36.32 69.09,35.81 66.55,35.81 66.04,35.31 66.04,34.54 v65.28,33.78 | v13.21,10.16 13.72,10.16 16,12.45 16,18.29 v17.02,19.3
  Bottom 0.305: v31.75,12.19 33.27,12.19 35.05,13.97 43.94,13.97 v44.45,13.46
#RST
  Top 0.305: IC1.2 21.61,41.93 JP7.1
AREF
  Top 0.305: JP18.6 22.35,3.56 22.35,8.64 JP4.1
AX
  Top 0.254: C10.1 22.21,15.97 U$1.12 23.41,16.55 24.13,17.27 26.16,17.27 26.92,16.51 27.69,16.51 30.48,19.3 30.48,21.84 32.08,23.44 IC5.5
AY
  Top 0.254: U$1.10 24.71,16.33 25.15,16.76 25.91,16.76 26.67,16 27.69,16 28.19,15.49 C11.1 28.96,15.64 28.96,17.02 30.99,19.05 30.99,21.59 32.19,22.79 IC5.6
AZ
  Top 0.254: U$1.8 27.47,15.2 28.45,14.22 C12.1 29.83,13.21 30.99,13.21 31.5,13.72 31.5,21.34 32.3,22.14 IC5.7
CH7  (via drill 0.51)
  Top 0.254: v40.39,26.92 40.13,26.92 37.34,24.13 37.34,22.61 36.22,21.49 IC5.8
  Bottom 0.254: v40.39,26.92 43.43,26.92 44.45,27.94 65.53,27.94 65.79,28.19 70.1,28.19 JP5.3
D+
  Top 0.254: X1.D+ 6.6,33.02 7.37,32.26 13.46,32.26 13.81,31.91 IC1.15
D-
  Top 0.254: X1.D- 7.4,33.24 7.87,32.77 13.72,32.77 14.46,32.02 IC1.16
GND  (via drill 0.51)  (109 unrouted)
  Top 0.254: 19.56,21.34 19.57,21.32 U1.2 21.86,21.32 21.87,21.34 | 21.87,21.34 U1.8 21.87,17.81 21.84,17.78 21.84,17.53 | 21.87,21.34 U1.27 21.84,22.53 21.84,23.62 | 25.65,30.23 25.65,27.51 | 25.65,30.23 25.65,31.5 | 24.64,30.23 23.11,30.23 | 24.64,30.23 25.65,30.23 | U3.2 24.63,30.21 24.64,30.23 | 25.65,27.51 25.65,26.67 | 25.65,27.51 U3.8
  Top 0.406: U4.2 28.96,10.41 28.19,9.65 v28.19,5.33
  other vias: 40.39,21.59 30.23,16.76 27.69,17.78 12.7,3.3 33.02,21.08 16,35.05 36.58,34.04 20.83,15.49 69.09,5.84 54.86,15.75 27.18,13.97 46.48,25.65 42.93,16.76 60.2,13.21 65.79,40.13 58.67,35.81 50.55,23.11 23.88,36.83 49.53,25.65 32.77,18.54 34.29,28.19 29.97,32.26 22.1,23.62
  pour Top (isolate 0.305): 0.25,43.18 72.64,43.43 72.64,0 0.25,-0.25
  pour Bottom (isolate 0.305): 0.25,43.18 73.41,43.43 73.41,0.25 0.25,0
MISO
  Top 0.254: U$7.1 61.21,40.89 63.25,40.89 66.04,38.1 66.04,35.81 64.52,34.29 62.48,34.29 61.47,33.27 61.47,31.5 59.94,29.97 59.94,28.19 60.58,27.56 U$4.8
MOSI
  Top 0.254: U$7.4 63.5,39.62 64.77,38.35 64.77,37.99 R11.1
MOSI/1.5
  Top 0.254: R11.2 65.02,35.56 64.26,34.8 62.23,34.8 60.71,33.27 60.71,32.12 R12.2 60.71,31.89 60.71,31.5 59.44,30.23 59.44,28.19 58.8,27.56 U$4.1
N$1
  Top 0.254: LED1.A 1.52,5.95 R5.1
N$2
  Top 0.254: R4.1 64.37,19.19 65.53,18.03 68.83,18.03 69.34,17.53 70.09,17.53 LED2.A
N$3
  Top 0.254: C8.1 29.46,26.92 29.21,26.67 27.94,26.67 27.68,26.93 U3.12
N$4
  Top 0.254: U3.15 30.57,28.21 C9.1
N$5
  Top 0.254: R10.1 65.02,32 66.29,33.27 69.58,33.27 LED3.A
N$6
  Top 0.254: R2.2 22.28,39.44
  Top 0.305: IC1.1 22.26,39.42 R2.2
N$7
  Top 0.254: R19.2 R15.2 53.61,25.02 U$4.3
N$8
  Top 0.254: U3.20 29.99,30.71 30.23,30.48 30.23,29.97 30.73,29.46 R3.2
N$9
  Top 0.254: U3.23 27.68,32.11 R7.1
N$10
  Top 0.254: IC2.7 IC2.8 R8.1
N$11
  Top 0.813: U$21.3 6.44,23.79 4.57,25.65 JP3.1
N$12
  Top 0.254: R1.2 25.29,23.73 25.65,23.37 25.65,21.93 U1.20
N$13
  Top 0.254: U1.6 19.93,19.32 C6.1
N$14
  Top 0.254: R14.2 R13.2 55.1,22.22 U$4.4
N$15
  Top 0.254: U1.1 20.7,23.61 R6.2
N$16
  Top 0.254: U1.12 23.87,18.04 24.13,17.78 26.02,17.78 C5.1
N$17
  Top 0.305: X1.VBUS 8.2,35.99 7.62,36.58 7.62,41.4 8.38,42.16 12.82,42.16 F1.1
N$18
  Top 0.254: U1.15 26.29,19.32 C7.1
N$20
  Top 0.254: C2.1 32.65,31.1 31.75,32 31.75,32.64 JP27.2
N$21
  Top 0.813: JP3.2 4.57,28.19 6.6,26.16 8.46,26.16 U$21.2
N$22
  Top 0.254: LED4.A 70.09,30.23 69.6,30.23 69.09,29.72 69.09,28.7 68.58,28.19 66.55,28.19 64.4,30.34 R21.1
N$23
  Top 0.254: C25.1 21.84,27.18 22.35,26.67 JP20.2
N$24  (via drill 0.51)
  Top 0.254: v19.81,28.19 19.01,29 IC1.23 | v65.53,30.73 68.58,30.73 69.09,31.24 70.09,31.24 LED3.C
  Bottom 0.254: v19.81,28.19 19.81,28.96 22.35,31.5 25.4,31.5 29.97,36.07 44.45,36.07 45.47,35.05 45.47,30.23 46.74,28.96 63.75,28.96 v65.53,30.73
N$25  (via drill 0.51)
  Top 0.254: v18.8,27.43 18.36,27.87 IC1.22 | v71.37,30.73 71.37,29.21 70.87,28.7 70.12,28.7 LED4.C
  Bottom 0.254: v71.37,30.73 67.06,30.73 64.77,28.45 46.48,28.45 44.96,29.97 44.96,34.8 44.2,35.56 30.23,35.56 25.65,30.99 22.61,30.99 20.83,29.21 20.83,27.94 20.07,27.18 19.05,27.18 v18.8,27.43
N$26
  Top 0.254: 64.37,16.88 R22.1 64.37,16.4 65.28,15.49 68.83,15.49 69.34,14.99 70.09,14.99 LED5.A
N$27
  Top 0.254: R23.1 64.37,21.48 65.28,20.57 69.58,20.57 LED6.A
N$28
  Top 0.813: JP3.3 6.09,30.73 U$21.1
N$29
  Top 0.254: JP25.2 27.56,21.86 C1.1
N$34
  Top 0.254: R28.1 2.79,16.76 JP6.2
N$36
  Top 0.254: JP6.1 R30.1
N$38
  Top 0.254: R32.1 2.79,14.22 JP16.3
N$40
  Top 0.254: R34.1 3.41,18.68 JP6.3
PB0  (via drill 0.51)
  Top 0.254: JP15.2 34.29,4.57 34.29,11.94 v34.8,12.45 | v57.91,21.84 R13.1
  Bottom 0.254: v34.8,12.45 35.31,12.45 36.32,13.46 41.66,13.46 42.67,12.45 56.64,12.45 57.91,13.72 v57.91,21.84
PC0
  Top 0.254: R22.2 JP12.8
PC1
  Top 0.254: R4.2 JP12.7
PC2
  Top 0.254: R23.2 JP12.6
PC3  (via drill 0.51)
  Top 0.254: IC5.16 43.11,23.44 v43.43,23.11
  Bottom 0.254: JP12.5 65.02,26.92 44.96,26.92 44.45,26.42 44.45,24.13 v43.43,23.11
PC4  (via drill 0.51)
  Top 0.254: IC5.18 43.28,24.74 v43.43,24.89
  Bottom 0.254: v43.43,24.89 43.43,26.16 44.7,27.43 65.28,27.43 65.79,26.92 JP12.4
PC6  (via drill 0.51)
  Top 0.254: R15.1 51.67,24.75 53.09,26.16 53.09,28.19 53.85,28.96 56.9,28.96 v57.91,29.97
  Bottom 0.254: JP12.2 65.53,32 64.52,30.99 64.52,30.48 63.5,29.46 58.42,29.46 v57.91,29.97
PC7  (via drill 0.51)
  Top 0.254: v47.24,32.46 47.55,32.46 48.01,32 U$8.2
  Bottom 0.254: JP12.1 65.53,32.51 65.28,32.51 64.01,31.24 64.01,30.73 63.25,29.97 59.44,29.97 58.42,30.99 57.4,30.99 55.88,29.46 50.24,29.46 v47.24,32.46
PD0  (via drill 0.51)
  Top 0.254: IC2.6 46.61,19.43 44.7,17.53 44.7,16 42.42,13.72 41.4,13.72 40.89,13.21 v40.89,11.43 | JP10.2 53.09,3.3 53.85,3.3 54.36,2.79 61.47,2.79 JP24.4 63.08,1.52 63.88,2.32 63.88,4.38 65.63,6.13 65.7,6.06 X2.3
  Bottom 0.254: JP10.2 52.32,5.08 46.48,10.92 41.4,10.92 v40.89,11.43
PD1  (via drill 0.51)
  Top 0.254: IC2.5 45.34,18.92 44.2,17.78 44.2,16.26 42.16,14.22 37.59,14.22 37.08,13.72 v37.08,11.94 | JP11.1 53.59,2.79 51.56,2.79 51.05,3.3 51.05,4.83 51.56,5.33 61.47,5.33 JP24.3 62.74,4.67 64.75,6.69 65.3,6.69 X2.4
  Bottom 0.254: JP11.1 53.59,2.79 53.59,4.57 46.74,11.43 42.16,11.43 41.15,12.45 37.59,12.45 v37.08,11.94
PD4  (via drill 0.51)
  Top 0.254: X2.1 66.8,3.56 67.56,4.32 v67.56,5.59
  Bottom 0.254: v67.56,5.59 67.56,7.11 66.8,7.87 61.72,7.87 61.21,7.37 61.21,3.3 60.71,2.79 56.13,2.79 JP10.1
PE0
  Top 0.254: R2.1 24.38,39.62 JP7.3
PE1  (via drill 0.51)
  Top 0.254: 19.66,36.17 v19.81,36.07 19.66,36.22 IC1.5
  Bottom 0.254: v19.81,36.07 19.81,37.59 JP7.2
PE6  (via drill 0.51)
  Top 0.254: U$33.7 16.26,8.51 | U$33.7 16.26,8.76 | R25.2 18.03,15.49 18.29,15.24 18.29,13.72 17.36,12.79 17.27,12.7 16.13,11.56 U$33.7 | U$33.7 16.13,5.21 v15.49,4.57
  Bottom 0.254: v15.49,4.57 18.03,2.03 19.56,2.03 26.42,8.89 34.8,8.89 38.35,5.33 38.35,2.79 JP11.7
PE7  (via drill 0.51)
  Top 0.254: R20.2 14.86,11.67 U$33.8 14.86,5.46 v13.97,4.57
  Bottom 0.254: JP15.5 26.92,4.83 25.91,5.84 24.13,5.84 19.3,1.02 17.53,1.02 v13.97,4.57
PF0
  Top 0.254: R9.1 R35.P$2 5.84,18.29 5.59,18.03 R34.2
  Bottom 0.254: JP8.1 35.56,40.64 35.56,39.88 34.8,39.12 28.45,39.12 23.88,34.54 20.83,34.54 7.11,20.83 7.11,19.3 R35.P$2
PF1
  Top 0.254: R28.2 4.97,16.51 R29.P$2 R36.1
  Bottom 0.254: JP9.1 36.83,39.62 35.81,38.61 28.7,38.61 24.13,34.04 21.08,34.04 7.62,20.57 7.62,18.03 R29.P$2
PF2
  Top 0.254: R30.2 5.33,15.49 R31.P$2 R37.1
  Bottom 0.254: JP8.2 38.35,40.89 38.35,38.61 37.85,38.1 28.96,38.1 24.38,33.53 21.34,33.53 8.13,20.32 8.13,16.76 R31.P$2
PF3
  Top 0.254: R32.2 4.83,14.22 R33.P$2 R38.1
  Bottom 0.254: JP9.2 39.62,39.12 38.1,37.59 29.21,37.59 24.64,33.02 21.59,33.02 8.64,20.07 8.64,15.49 R33.P$2
PF4
  Bottom 0.254: JP8.3 40.89,40.89 40.89,38.86 39.12,37.08 29.46,37.08 24.89,32.51 21.84,32.51 9.14,19.81 9.14,15.24 7.37,13.46 7.37,12.45 6.6,11.68 2.79,11.68 JP16.2
PF5
  Bottom 0.254: JP9.3 42.16,39.37 39.37,36.58 29.72,36.58 25.15,32 22.1,32 9.65,19.56 9.65,14.99 7.87,13.21 7.87,12.19 6.86,11.18 3.56,11.18 2.79,10.41 2.79,9.14 JP16.1
PF6
  Bottom 0.254: JP21.3 51.05,37.08 50.29,37.85 44.45,37.85 43.43,38.86 43.43,40.89 JP8.4
PF7
  Bottom 0.254: JP22.3 53.59,38.35 45.97,38.35 JP9.4
PG0
  Top 0.254: JP13.2 S1.3 61.85,13.34 60.59,12.08 R24.1
  Bottom 0.254: JP13.2 62.74,14.22 59.94,11.43 JP23.2
PG1  (via drill 0.51)
  Top 0.254: S2.2 7.87,8.13 v11.68,11.94
  Bottom 0.254: v11.68,11.94 11.68,8.89 12.45,8.13 16,8.13 18.03,10.16 22.1,10.16 22.86,10.92 35.81,10.92 36.07,11.18 36.07,12.45 36.58,12.95 41.4,12.95 42.42,11.94 56.9,11.94 60.96,16 65.79,16 JP13.1
PH0
  Top 0.254: JP18.4 30.73,2.79 30.73,4.83 31.24,5.33 32.77,5.33 33.27,5.84 33.27,16.76 34.54,18.03 38.1,18.03 39.37,19.3 39.37,22.35 39.81,22.79 IC5.15
PH1
  Top 0.254: IC5.17 39.58,24.09 38.86,23.37 38.86,19.56 37.85,18.54 34.29,18.54 32.77,17.02 32.77,6.35 32.26,5.84 30.99,5.84 29.46,4.32 JP15.4
PH2  (via drill 0.51)
  Top 0.254: JP18.3 33.27,2.79 33.27,4.83 33.78,5.33 33.78,16.51 34.29,17.02 v35.31,17.02 | IC5.19 40.12,25.39 38.35,23.62 38.35,20.57 v37.85,20.07
  Bottom 0.254: v37.85,20.07 37.85,19.56 v35.31,17.02
PJ0
  Top 0.254: JP14.3 68.83,37.08 JP2.4
PJ1
  Top 0.254: JP14.2 68.83,39.62 JP2.3
PL2  (via drill 0.51)
  Top 0.254: U$21.5 14.42,20.38 14.48,20.32 v12.45,20.32
  Bottom 0.254: JP10.5 44.7,5.33 40.64,9.4 26.16,9.4 20.07,3.3 18.29,3.3 16,5.59 12.19,5.59 11.18,6.6 11.18,11.18 10.67,11.68 10.67,12.45 11.18,12.95 11.18,19.81 11.68,20.32 v12.45,20.32
PL6  (via drill 0.51)
  Top 0.254: U$33.6 17.27,8.76 | R26.2 17.53,16.76 18.8,15.49 18.8,12.84 17.45,11.49 17.4,11.44 U$33.6 | U$33.6 17.4,5.97 v17.27,5.84
  Bottom 0.254: JP10.3 49.78,6.1 45.97,9.91 25.91,9.91 20.57,4.57 18.54,4.57 v17.27,5.84
PL7  (via drill 0.51)
  Top 0.254: v18.8,6.1 18.67,6.22 U$33.5 18.67,11.41 19.3,12.04 19.3,15.75 18.29,16.76 18.29,17.16 R27.2
  Bottom 0.254: JP11.2 51.05,2.79 51.05,5.59 46.23,10.41 23.11,10.41 v18.8,6.1
RST  (via drill 0.51)
  Top 0.305: S3.3 34.54,38.35 35.31,37.59 42.16,37.59 v42.42,37.34
  Bottom 0.254: v42.42,37.34 50.04,37.34 51.05,36.32 51.05,34.04 51.82,33.27 58.67,33.27 59.94,34.54 U$7.5
SCK
  Top 0.254: R17.1 59.32,40.27 U$7.3
SCK/1.5
  Top 0.254: R18.2 R17.2 | R18.2 57.52,36.58 | U$4.2 53.97,26.29 53.59,26.67 53.59,27.94 54.1,28.45 58.17,28.45 58.93,29.21 58.93,30.23 58.17,30.99 57.4,30.99 56.9,31.5 56.9,33.78 56.39,34.29 56.39,35.56 57.15,36.32 57.26,36.32 R18.2
SCL1
  Top 0.254: R43.1 U$8.6 45.97,32 46.48,31.5 46.48,28.7 46.61,28.57 IC2.3
SDA1
  Top 0.254: U$8.7 45.18,30.51 | U$8.7 R42.1 | IC2.4 45.34,30.57 U$8.7
TEMP
  Top 0.254: IC5.4 35.77,24.09 36.07,24.38 36.07,28.96 34.04,30.99 34.04,32.77 33.02,33.78 28.34,33.78 R7.2 28.05,33.78 27.43,33.78 26.92,33.27 C26.1
WP
  Top 0.254: U$4.5 62.37,23.56 | 65.01,23.75 R16.1
  Top 0.305: U$4.5 65.01,23.75
XOUT
  Top 0.254: IC5.2 34.69,25.4 25.65,25.4 25.15,25.91 23.73,25.91 23.37,25.54 23.37,25.15 23.11,24.89 JP20.1 22.21,25.03 R6.1
YOUT
  Top 0.254: R1.1 25.26,25.03 25.55,24.74 28.45,24.74 | 28.45,24.74 IC5.3 | 28.45,24.74 JP25.1
ZOUT
  Top 0.254: IC5.1 35.56,26.9 35.56,28.7 34.8,29.46 | R3.1 34.8,29.46 | JP27.1 33.02,32.77 33.53,32.26 33.53,30.73 34.8,29.46

### Text on the board
tPlace: FUSE | TelemPort | RST | Pressure | GYRO-Z | Sensor | USB | Expansion | TX | 10uF | DF | ADC 12Bits | Ports | RX | FTDI | Pitot | Relay | SW1 | 10uF | C | GYRO-XY | 10uF | I2C Traslator | B | DOWN=LOW | Accel | 47uF Cap | A | Volt | Dividers | Analog 3.3V | Front | Digital 3.3V | 3.3V | SW1 | I2C Port | NO GPS! | ON | VRef | 0 | 1 | SW2
bPlace: AVR-ISP | DTR | TXO | RXI | +5V | CTS | GND | GND | +5V | AN6 | AN7 | OUT | +5V | +5V | IN | GND | GND | 1 | PL2(47) | Relay | IN | 0 | GND | +5V | AN0 | GND | HOTEL1.0 | AN1 | AN2 | AN3 | 8/19/2010 | AN4 | GND | AN5 | +5V | =) | SW1 | PG0(41) | SDA | +3.3V | PD2/PD3 | SCL